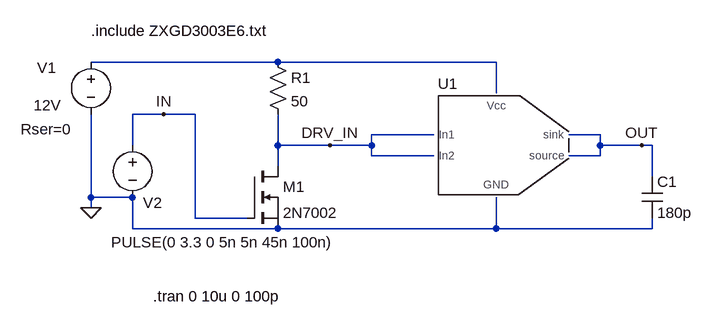
[diagram p0: schematic mosfet-driver.asc]
mosfet-driver.asc, the LTspice schematic file:
Version 4
SHEET 1 880 680
WIRE 192 64 -96 64
WIRE 528 64 192 64
WIRE 528 112 528 64
WIRE 16 144 -32 144
WIRE 64 144 16 144
WIRE 432 176 336 176
WIRE 688 176 640 176
WIRE -32 192 -32 144
WIRE 192 192 192 144
WIRE 272 192 192 192
WIRE 336 192 336 176
WIRE 336 192 272 192
WIRE 688 192 688 176
WIRE 752 192 688 192
WIRE 768 192 752 192
WIRE 336 208 336 192
WIRE 432 208 336 208
WIRE 688 208 688 192
WIRE 688 208 640 208
WIRE 192 224 192 192
WIRE 768 240 768 192
WIRE -96 272 -96 144
WIRE -32 272 -96 272
WIRE -96 288 -96 272
WIRE 64 304 64 144
WIRE 144 304 64 304
WIRE -32 320 -32 272
WIRE 192 320 -32 320
WIRE 528 320 528 272
WIRE 528 320 192 320
WIRE 768 320 768 304
WIRE 768 320 528 320
FLAG -96 288 0
FLAG 752 192 OUT
FLAG 272 192 DRV_IN
FLAG 16 144 IN
SYMBOL voltage -96 48 R0
WINDOW 0 -83 25 Left 2
WINDOW 3 -88 82 Left 2
WINDOW 39 -108 119 Left 2
SYMATTR InstName V1
SYMATTR Value 12V
SYMATTR SpiceLine Rser=0
SYMBOL voltage -32 176 R0
WINDOW 0 16 104 Left 2
WINDOW 3 -33 165 Left 2
SYMATTR InstName V2
SYMATTR Value PULSE(0 3.3 0 5n 5n 45n 100n)
SYMBOL cap 752 240 R0
SYMATTR InstName C1
SYMATTR Value 180p
SYMBOL mosfet_driver 528 192 R0
SYMATTR InstName U1
SYMBOL nmos 144 224 R0
SYMATTR InstName M1
SYMATTR Value 2N7002
SYMBOL res 176 48 R0
SYMATTR InstName R1
SYMATTR Value 50
TEXT -96 16 Left 2 !.include ZXGD3003E6.txt
TEXT 0 424 Left 2 !.tran 0 10u 0 100p

The netlist it stands for:
* mosfet-driver.asc
V1 N001 0 12V Rser=0
V2 IN 0 PULSE(0 3.3 0 5n 5n 45n 100n)
C1 OUT 0 180p
XU1 N001 DRV_IN 0 OUT DRV_IN OUT ZXGD3003E6  ; pins Vcc In1 GND sink In2 source
M1 DRV_IN IN 0 0 2N7002
R1 N001 DRV_IN 50
.model NMOS NMOS
.model PMOS PMOS
.lib standard.mos
.include ZXGD3003E6.txt
.tran 0 10u 0 100p
.backanno
.end